# Altium schematic sheet CircuitoControle.SchDoc: Sanhaço - Ckt Controle
size A4; DocumentNumber: CB03; Revision: 1.1; SheetNumber: 3; SheetTotal: 4
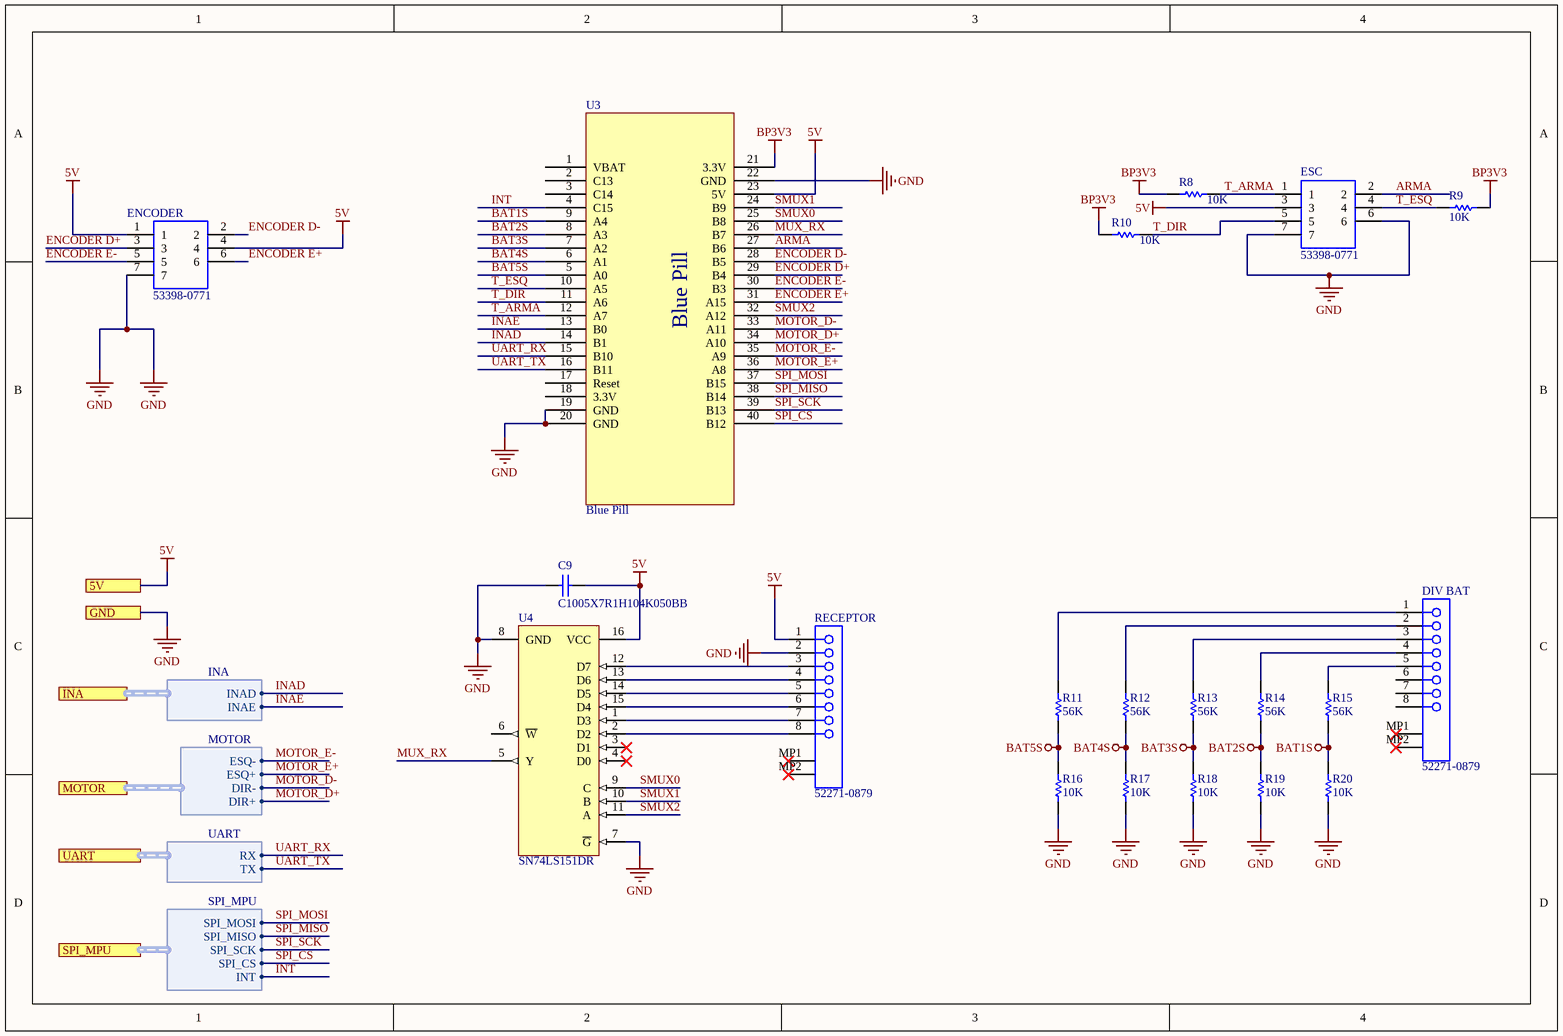
[diagram p0: CircuitoControle.SchDoc]

## Parts
C9  C1005X7R1H104K050BB  [TDK-C1005-2_M]
DIV_BAT  52271-0879  [MOLX-52271-0879]
ENCODER  53398-0771  [53398-0771]
ESC  53398-0771  [53398-0771]
R8  10K  [RESC0402(1005)_L]
R9  10K  [RESC0402(1005)_L]
R10  10K  [RESC0402(1005)_L]
R11  56K  [RESC0402(1005)_N]
R12  56K  [RESC0402(1005)_N]
R13  56K  [RESC0402(1005)_N]
R14  56K  [RESC0402(1005)_N]
R15  56K  [RESC0402(1005)_N]
R16  10K  [RESC0402(1005)_L]
R17  10K  [RESC0402(1005)_L]
R18  10K  [RESC0402(1005)_L]
R19  10K  [RESC0402(1005)_L]
R20  10K  [RESC0402(1005)_L]
RECEPTOR  52271-0879  [MOLX-52271-0879]
U3  Blue Pill  [blue pill]
U4  SN74LS151DR  [D0016A_L]

## Ports
5V, GND, INA (harness INA), MOTOR (harness MOTOR), SPI_MPU (harness SPI_MPU), UART (harness UART)

## Harnesses
UART: RX, TX
SPI_MPU: SPI_MOSI, SPI_MISO, SPI_SCK, SPI_CS, INT
INA: INAD, INAE
MOTOR: ESQ+, DIR-, DIR+, ESQ-

## Nets
5V: C9.2 ENCODER.1 ENCODER.4 ESC.3 RECEPTOR.1 U3.23(5V) U4.16(VCC) ; port 5V
BAT1S: R15.1 R20.2 U3.9(A4)
BAT2S: R14.1 R19.2 U3.8(A3)
BAT3S: R13.1 R18.2 U3.7(A2)
BAT4S: R12.1 R17.2 U3.6(A1)
BAT5S: R11.1 R16.2 U3.5(A0)
BP3V3: R8.2 R9.1 R10.2 U3.21(3.3V)
GND: C9.1 ENCODER.7 ESC.6 ESC.7 R16.1 R17.1 R18.1 R19.1 R20.1 RECEPTOR.2 U3.19(GND) U3.20(GND) U3.22(GND) U4.7(~{G}) U4.8(GND) ; port GND
ARMA: ESC.2 U3.27(B6)
ENCODER D+: ENCODER.3 U3.29(B4)
ENCODER D-: ENCODER.2 U3.28(B5)
ENCODER E+: ENCODER.6 U3.31(A15)
ENCODER E-: ENCODER.5 U3.30(B3)
INAD: U3.14(B1) ; port INA.INAD
INAE: U3.13(B0) ; port INA.INAE
INT: U3.4(C15) ; port SPI_MPU.INT
MOTOR_D+: U3.34(A10) ; port MOTOR.DIR+
MOTOR_D-: U3.33(A11) ; port MOTOR.DIR-
MOTOR_E+: U3.36(A8) ; port MOTOR.ESQ+
MOTOR_E-: U3.35(A9) ; port MOTOR.ESQ-
MUX_RX: U3.26(B7) U4.5(Y)
SMUX0: U3.25(B8) U4.9(C)
SMUX1: U3.24(B9) U4.10(B)
SMUX2: U3.32(A12) U4.11(A)
SPI_CS: U3.40(B12) ; port SPI_MPU.SPI_CS
SPI_MISO: U3.38(B14) ; port SPI_MPU.SPI_MISO
SPI_MOSI: U3.37(B15) ; port SPI_MPU.SPI_MOSI
SPI_SCK: U3.39(B13) ; port SPI_MPU.SPI_SCK
T_ARMA: ESC.1 R8.1 U3.12(A7)
T_DIR: ESC.5 R10.1 U3.11(A6)
T_ESQ: ESC.4 R9.2 U3.10(A5)
UART_RX: U3.15(B10) ; port UART.RX
UART_TX: U3.16(B11) ; port UART.TX
NetDIV_BAT_1: DIV_BAT.1 R11.2
NetDIV_BAT_2: DIV_BAT.2 R12.2
NetDIV_BAT_3: DIV_BAT.3 R13.2
NetDIV_BAT_4: DIV_BAT.4 R14.2
NetDIV_BAT_5: DIV_BAT.5 R15.2
NetRECEPTOR_3: RECEPTOR.3 U4.12(D7)
NetRECEPTOR_4: RECEPTOR.4 U4.13(D6)
NetRECEPTOR_5: RECEPTOR.5 U4.14(D5)
NetRECEPTOR_6: RECEPTOR.6 U4.15(D4)
NetRECEPTOR_7: RECEPTOR.7 U4.1(D3)
NetRECEPTOR_8: RECEPTOR.8 U4.2(D2)

Not connected (* = marked no-connect by the designer): DIV_BAT 6 7 8 MP1* MP2*; RECEPTOR MP1* MP2*; U3 1(VBAT) 2(C13) 3(C14) 17(Reset) 18(3.3V); U4 3(D1)* 4(D0)* 6(~{W})

## Notes on the sheet
- Title
- Size:
- Date:
- A4
- Number:
- Time:
- Revision:
- Sheet
- of
- File:

## Library data of the parts
C9 = CMP-2000-05393-1: Chip Capacitor, 0.1 uF, +/- 10%, 50 V, -55 to 125 degC, 0402(1005 Metric), RoHS, Tape and Reel; PCN Part Number: MLCCPartNumberChange30/Nov/2012; Manufacturer: TDK; Product Training Modules: CSeriesGeneralApplicationsSEAT,CCV,andTVCLDesignToolsGuidetoReplacinganElectrolyticCapacitorwithanMLCC; Other Names: 445-5932-1; Kits: 445-9021-KIT-ND-KITMLCC100PF-10UF04026.3-50V445-9003-KIT-ND-KITCAPCERHICAPMLCCSMD; Voltage - Rated: 50V; Temperature Coefficient: X7R; Capacitance: 0.1µF; Online Catalog: CSeries,GeneralPurpose; Manufacturer URL: http://www.tdk.com/; Category: Capacitors; Mounting Type: SurfaceMount,MLCC; Datasheet Version: Mar-15; Datasheet URL: http://www.farnell.com/datasheets/1913358.pdf; Packaging: CutTape(CT); Standard Package: 1; Features: -; Operating Temperature: -55degC~125degC; Tolerance: ±10%; RoHS Information: RoHSCertificate-MLCC; Applications: GeneralPurpose; Lead Style: -; Ratings: -; Height - Seated (Max): -; Lead Spacing: -; Package / Case: 0402(1005Metric); Series: C; Family: CeramicCapacitors
DIV_BAT RECEPTOR = CMP-1241-00231-1: 1.0 mm Pitch Easy-On(TM) Type FPC Connector, 3.0 mm Mated Height, Right Angle, ZIF, SMT, Bottom Contact, 8 Circuits, -40 to 85 degC, ELV and RoHS Compliant, Tape and Reel; Manufacturer: Molex; Mated Height: 3.00mm; PCB Retention: Yes; Voltage (Max): 50V AC (RMS)/DC; Material - Metal: Phosphor Bronze; PCB Locator: No; Circuits (Loaded): 8; Material - Plating Termination: Tin-Bismuth; Entry Angle: 90degrees Angle; Pitch - Mating Interface: 1.00mm; Current (Max per Contact): 0.5A; Durability (mating cycles max): 30; PackageReference: 52271-0879; PackageDescription: 8-Lead FPC Connector, Pitch 1.0 mm; Mounting Technology: Surface Mount; ComponentLink1URL: http://www.molex.com/molex/index.jsp; Number of Rows: 1; PackageVersion: Rev. B, 04/2004; ComponentLink1Description: Manufacturer URL; Contact Position: Bottom; RoHS: TRUE; ComponentLink3URL: http://www.molex.com/pdm_docs/sd/522710879_sd.pdf; PartNumber: 52271-0879; Orientation: Right Angle; Stackable: No; ComponentLink2URL: http://www.molex.com/webdocs/datasheets/pdf/en-us/0522710879_FFC_FPC_CONNECTORS.pdf; ComponentLink3Description: Package Specification; ComponentLink2Description: Datasheet; Polarized to PCB: Yes; Packing: Tape and Reel; Material - Plating Mating: Tin-Bismuth; Pitch - Termination Interface: 1.00mm
ENCODER ESC = 53398-0771: 7 way SMT straight header Molex PICOBLADE Series, Series Number 53398, 1.25mm Pitch 7 Way 1 Row Straight PCB Header, Solder Termination, 1A; Allied_Number: 70373150; Manufacturer_Name: Molex; Manufacturer_Part_Number: 53398-0771; RS Part Number: 5427220P; RS Price/Stock: http://uk.rs-online.com/web/p/products/5427220P; Allied Price/Stock: http://www.alliedelec.com/molex-incorporated-53398-0771/70373150/; Arrow Part Number: 53398-0771; Arrow Price/Stock: http://uk.rs-online.com/web/p/products/5427220P; Datasheet Link: http://www.molex.com/webdocs/datasheets/pdf/en-us/0533980771_PCB_HEADERS.pdf
R8-R10 R16-R20 = CMP-1011-00623-1: 10K 0.063W 1% 0402 (1005 Metric)  SMD; Manufacturer: Vishay; Manufacturer Part Number: ERJ-2RKF1002X; Case-Metric: 1005; Value: 10000.00 Ohm; Case-EIA: 0402; Power Rating: 62.5mW; Resistance: 10kR; Temperature Coefficient: 100ppm/°C; Tolerance: 1 %; Technology: SMT; Power: 0.063 W; Supplier 1: Mouser; Supplier Part Number 1: 71-CRCW040210K0FKEDC; Stock 1: 1778155; Pricing 1: 1=0.13, 10=0.051, 50=0.051, 100=0.029, 1000=0.029, 10000=0.005 (USD); Mount: Surface Mount; Case/Package: Molded; Contact Plating: Tin; Min Operating Temperature: -55°C; Max Operating Temperature: 155°C; Composition: Thick Film; Termination: Wraparound; Length: 1mm; Lead Free: Lead Free
R11-R15 = CMP-1011-00708-1: 56K 0.063W 1% 0402 (1005 Metric)  SMD; Manufacturer: Bourns; Manufacturer Part Number: CR0402-FX-5602GLF; Value: 56000.00 Ohm; Case-EIA: 0402; Case-Metric: 1005; Resistance: 56kR; Power Rating: 62.5mW; Voltage Rating: 50V; Temperature Coefficient: 100ppm/°C; Max Power Dissipation: 63mW; Tolerance: 1 %; Power: 0.063 W; Technology: SMT; Supplier 1: Mouser; Supplier Part Number 1: 652-CR0402FX-5602GLF; Stock 1: 37564; Pricing 1: 1=0.1, 10=0.022, 50=0.022, 100=0.013, 1000=0.008, 10000=0.005 (USD); Mount: Surface Mount; Case/Package: 0402; Case Code (Imperial): 0402; Case Code (Metric): 1005; Contact Plating: Tin; Min Operating Temperature: -55°C; Max Operating Temperature: 125°C; Packaging: Tape and Reel; Package Quantity: 1; Composition: Thick Film; Termination: SMD/SMT; Number of Terminations: 2; Military Standard: Not; Length: 1mm; Height: 0.016inch; Width: 0.5mm; Depth: 0.5mm; Thickness: 356um; Radiation Hardening: No; ComponentLink1URL: https://www.bourns.com/docs/Product-Datasheets/CR0402.pdf?src-supplier=Digi-Key; ComponentLink1Description: https://www.bourns.com/docs/Product-Datasheets/CR0402.pdf?src-supplier=Digi-Key; ComponentLink2URL: http://www.bourns.com/pdfs/CR0402.pdf?src-supplier=Avnet; ComponentLink2Description: http://www.bourns.com/pdfs/CR0402.pdf?src-supplier=Avnet
U4 = CMP-1633-00148-1: 8-Line To 1-Line Data Selectors/Multiplexers, D0016A, LARGE T&R; Manufacturer: Texas Instruments; VCC(Max)(V): 5.25; Configuration: "16","1"; Channels(#): 1; F @ Nom Voltage(Max)(Mhz): 35; Input Type: TTL; Output Drive (IOL/IOH)(Max)(mA): 8/-0.4; Voltage(Nom)(V): 5; Bits(#): 16; VCC(Min)(V): 4.75; Technology Family: LS; tpd @ Nom Voltage(Max)(ns): 38; Function: Encoder/Multiplexer; Schmitt Trigger: No; Rating: Catalog; ICC @ Nom Voltage(Max)(mA): 10; PartNumber: SN74LS151DR; Operating Temperature Range(C): 0 to 70; Type: Standard; ComponentLink3URL: http://www.ti.com/lit/ml/mpds178g/mpds178g.pdf; ComponentLink1Description: Manufacturer URL; ComponentLink2Description: Datasheet; DatasheetVersion: SDLS054; Output Type: TTL; PackageReference: D0016A; ComponentLink1URL: http://www.ti.com/; Code_JEDEC: MS-012 variation AC; ComponentLink2URL: http://www.ti.com/lit/ds/symlink/sn74ls151.pdf; ComponentLink3Description: Package Specification; Generic Part Number: SN74LS151